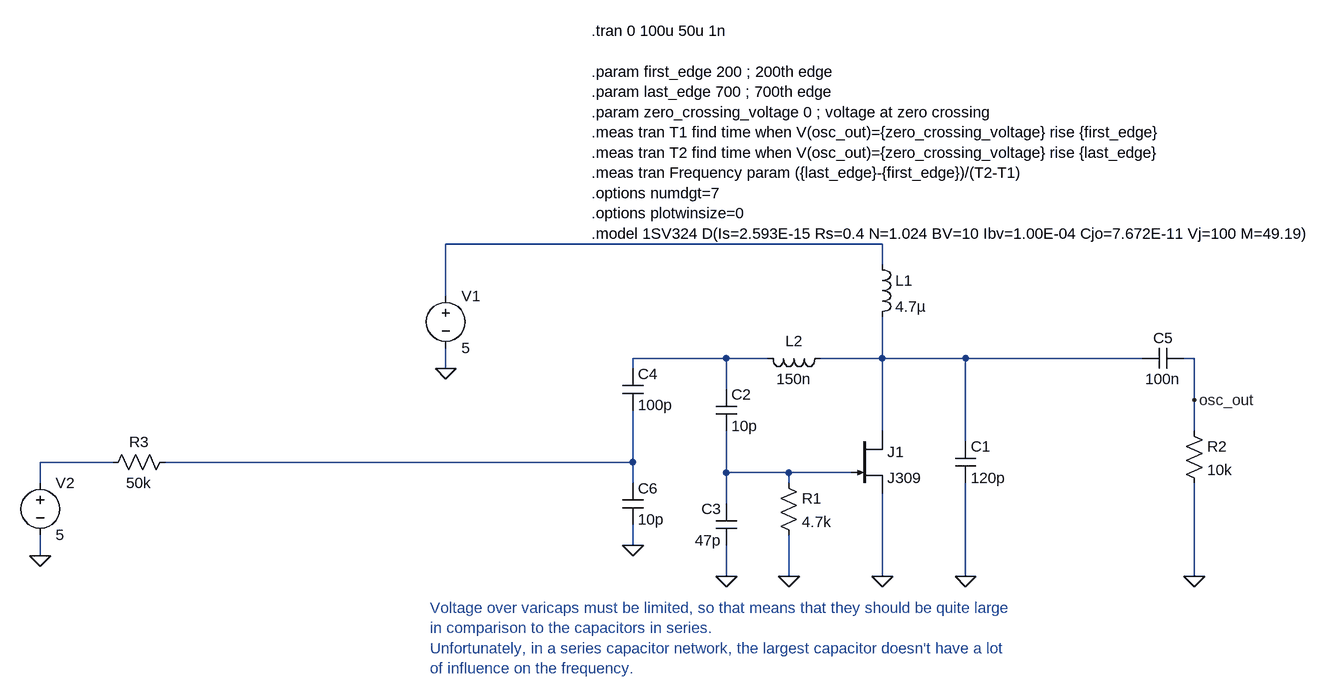
[diagram p0: schematic design2.asc]
design2.asc, the LTspice schematic file:
Version 4
SHEET 1 1232 820
WIRE -560 112 -1232 112
WIRE -560 144 -560 112
WIRE -1232 192 -1232 112
WIRE -800 288 -944 288
WIRE -736 288 -800 288
WIRE -560 288 -560 224
WIRE -560 288 -656 288
WIRE -432 288 -560 288
WIRE -160 288 -432 288
WIRE -80 288 -96 288
WIRE -1232 304 -1232 272
WIRE -944 304 -944 288
WIRE -800 336 -800 288
WIRE -80 352 -80 288
WIRE -560 400 -560 288
WIRE -80 400 -80 352
WIRE -432 416 -432 288
WIRE -1744 448 -1856 448
WIRE -944 448 -944 368
WIRE -944 448 -1664 448
WIRE -800 464 -800 400
WIRE -704 464 -800 464
WIRE -608 464 -704 464
WIRE -1856 480 -1856 448
WIRE -944 480 -944 448
WIRE -704 480 -704 464
WIRE -800 512 -800 464
WIRE -944 576 -944 544
WIRE -1856 592 -1856 560
WIRE -800 624 -800 576
WIRE -704 624 -704 560
WIRE -560 624 -560 496
WIRE -432 624 -432 480
WIRE -80 624 -80 480
FLAG -1232 304 0
FLAG -800 624 0
FLAG -560 624 0
FLAG -704 624 0
FLAG -432 624 0
FLAG -80 624 0
FLAG -80 352 osc_out
FLAG -1856 592 0
FLAG -944 576 0
DATAFLAG -688 464 ""
SYMBOL njf -608 400 R0
SYMATTR InstName J1
SYMATTR Value J309
SYMBOL ind -576 128 R0
SYMATTR InstName L1
SYMATTR Value 4.7µ
SYMATTR SpiceLine Rser=10
SYMBOL res -720 464 R0
SYMATTR InstName R1
SYMATTR Value 4.7k
SYMBOL cap -816 336 R0
SYMATTR InstName C2
SYMATTR Value 10p
SYMBOL cap -784 576 R180
WINDOW 0 24 56 Left 2
WINDOW 3 24 8 Left 2
SYMATTR InstName C3
SYMATTR Value 47p
SYMBOL ind -640 272 R90
WINDOW 0 5 56 VBottom 2
WINDOW 3 32 56 VTop 2
SYMATTR InstName L2
SYMATTR Value 150n
SYMATTR SpiceLine Rser=0.2
SYMBOL voltage -1232 176 R0
WINDOW 123 0 0 Left 0
WINDOW 39 0 0 Left 0
SYMATTR InstName V1
SYMATTR Value 5
SYMBOL cap -448 416 R0
SYMATTR InstName C1
SYMATTR Value 120p
SYMBOL res -96 384 R0
SYMATTR InstName R2
SYMATTR Value 10k
SYMBOL cap -96 272 R90
WINDOW 0 0 32 VBottom 2
WINDOW 3 32 32 VTop 2
SYMATTR InstName C5
SYMATTR Value 100n
SYMBOL cap -960 304 R0
SYMATTR InstName C4
SYMATTR Value 100p
SYMBOL res -1648 432 R90
WINDOW 0 0 56 VBottom 2
WINDOW 3 32 56 VTop 2
SYMATTR InstName R3
SYMATTR Value 50k
SYMBOL voltage -1856 464 R0
WINDOW 123 0 0 Left 0
WINDOW 39 0 0 Left 0
SYMATTR InstName V2
SYMATTR Value 5
SYMBOL cap -960 480 R0
SYMATTR InstName C6
SYMATTR Value 10p
TEXT -1008 -216 Left 2 !.tran 0 100u 50u 1n\n \n.param first_edge 200 ; 200th edge\n.param last_edge 700 ; 700th edge\n.param zero_crossing_voltage 0 ; voltage at zero crossing\n.meas tran T1 find time when V(osc_out)={zero_crossing_voltage} rise {first_edge}\n.meas tran T2 find time when V(osc_out)={zero_crossing_voltage} rise {last_edge}\n.meas tran Frequency param ({last_edge}-{first_edge})/(T2-T1)\n.options numdgt=7\n.options plotwinsize=0\n.model 1SV324 D(Is=2.593E-15 Rs=0.4 N=1.024 BV=10 Ibv=1.00E-04 Cjo=7.672E-11 Vj=100 M=49.19)
TEXT -1256 672 Left 2 ;Voltage over varicaps must be limited, so that means that they should be quite large\nin comparison to the capacitors in series.\nUnfortunately, in a series capacitor network, the largest capacitor doesn't have a lot \nof influence on the frequency.

The netlist it stands for:
* design2.asc
J1 N003 N006 0 J309
L1 N001 N003 4.7µ Rser=10
R1 N006 0 4.7k
C2 N002 N006 10p
C3 0 N006 47p
L2 N003 N002 150n Rser=0.2
V1 N001 0 5
C1 N003 0 120p
R2 osc_out 0 10k
C5 osc_out N003 100n
C4 N002 N005 100p
R3 N005 N004 50k
V2 N004 0 5
C6 N005 0 10p
.model NJF NJF
.model PJF PJF
.lib standard.jft
.tran 0 100u 50u 1n
.param first_edge 200 ; 200th edge
.param last_edge 700 ; 700th edge
.param zero_crossing_voltage 0 ; voltage at zero crossing
.meas tran T1 find time when V(osc_out)={zero_crossing_voltage} rise {first_edge}
.meas tran T2 find time when V(osc_out)={zero_crossing_voltage} rise {last_edge}
.meas tran Frequency param ({last_edge}-{first_edge})/(T2-T1)
.options numdgt=7
.options plotwinsize=0
.model 1SV324 D(Is=2.593E-15 Rs=0.4 N=1.024 BV=10 Ibv=1.00E-04 Cjo=7.672E-11 Vj=100 M=49.19)
* Voltage over varicaps must be limited, so that means that they should be quite large
* in comparison to the capacitors in series.
* Unfortunately, in a series capacitor network, the largest capacitor doesn't have a lot
* of influence on the frequency.
.backanno
.end